# EAGLE design Kitty_Cannon_Schematic (EAGLE 9.6.2)
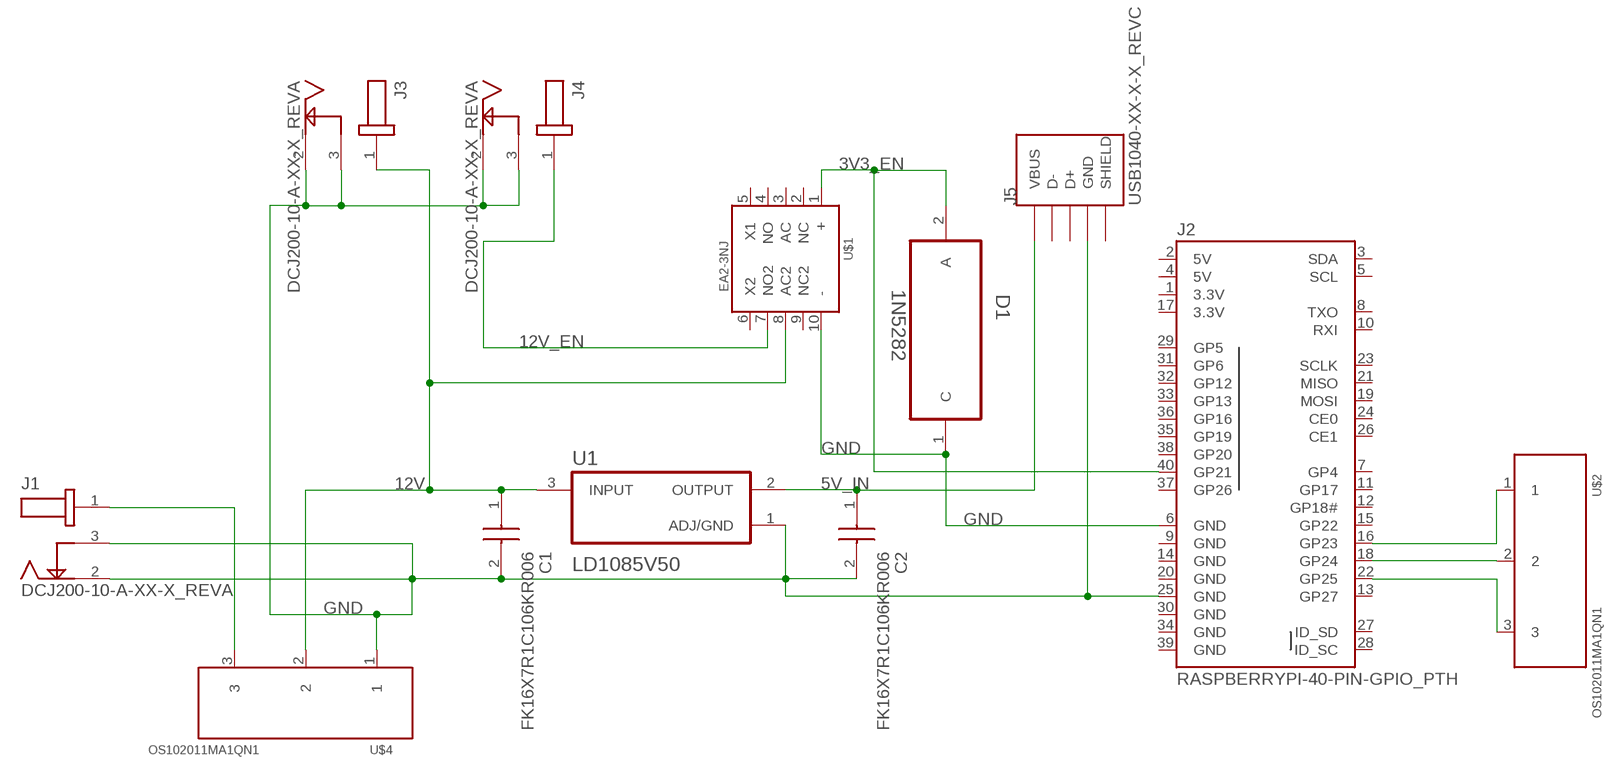
[diagram p0: schematic, sheet 1]

## Parts
C1  FK16X7R1C106KR006  [FK16]
C2  FK16X7R1C106KR006  [FK16]
D1  1N5282  [DIO_1N5282]
J1  DCJ200-10-A-XX-X_REVA  [GCT_DCJ200-10-A-XX-X_REVA]
J2  RASPBERRYPI-40-PIN-GPIO_PTH  [2X20_SHROUDED]
J3  DCJ200-10-A-XX-X_REVA  [GCT_DCJ200-10-A-XX-X_REVA]
J4  DCJ200-10-A-XX-X_REVA  [GCT_DCJ200-10-A-XX-X_REVA]
J5  USB1040-XX-X-X_REVC  [GCT_USB1040-XX-X-X_REVC]
U1  LD1085V50  [TO-220-3]
U$1  EA2-3NJ  [EA2-3NJ]
U$2  OS102011MA1QN1  [OS102011MA1QN1]
U$4  OS102011MA1QN1  [OS102011MA1QN1]

## Nets
3V3_EN: D1.2(A) J2.40(GP21) U$1.1(+)
5V_IN: C2.1 J5.1(VBUS) U1.2(OUTPUT)
12V: C1.1 J3.1 U1.3(INPUT) U$1.8(AC2) U$4.2
12V_EN: J4.1 U$1.7(NO2)
GND: C1.2 C2.2 D1.1(C) J1.2 J1.3 J2.6(GND) J2.25(GND) J3.2 J3.3 J4.2 J4.3 J5.4(GND) U1.1(ADJ/GND) U$1.10(-) U$4.1
N$1: J2.22(GP25) U$2.3
N$2: J2.16(GP23) U$2.1
N$3: J1.1 U$4.3
N$7: J2.18(GP24) U$2.2
Unconnected: J2.3(SDA) J2.5(SCL) J2.7(GP4) J2.8(TXO) J2.10(RXI) J2.11(GP17) J2.12(GP18#) J2.13(GP27) J2.15(GP22) J2.19(MOSI) J2.21(MISO) J2.23(SCLK) J2.24(CE0) J2.26(CE1) J2.27(ID_SD) J2.28(ID_SC) J2.29(GP5) J2.31(GP6) J2.32(GP12) J2.33(GP13) J2.35(GP19) J2.36(GP16) J2.37(GP26) J2.38(GP20) J5.2(D-) J5.3(D+) U$1.2(NC) U$1.3(AC) U$1.4(NO) U$1.5(X1) U$1.6(X2) U$1.9(NC2)

## Power pins joined to a net without a drawn wire
3.3V: J2.1(3.3V) J2.17(3.3V)
5V: J2.2(5V) J2.4(5V)
GND: J2.9(GND) J2.14(GND) J2.20(GND) J2.30(GND) J2.34(GND) J2.39(GND)
SHIELD: J5.5(SHIELD) J5.6(SHIELD)

## Library data of the parts
C1 C2 = FK16X7R1C106KR006:FK16X7R1C106KR006: MLCC with Dipped Radial Lead, Capacitance=10uF, LxWxT:5.5x6x3.5mm, Lead pitch:2.5mm Source: Datasheet <https://product.tdk.com/system/files/dam/doc/product/capacitor/ceramic/lead-mlcc/catalog/leadmlcc_conventional_fk_en.pdf>; DESCRIPTION: MLCC with Dipped Radial Lead, Capacitance=10uF, LxWxT:5.5x6x3.5mm, Lead pitch:2.5mm; HEIGHT: 6mm; MANUFACTURER_NAME: TDK; MANUFACTURER_PART_NUMBER: FK16X7R1C106KR006
D1 = 1N5282:1N5282: Small Signal Diode Check prices <https://pricing.snapeda.com/parts/1N5282/ON/view-part?ref=eda>; AVAILABILITY: In Stock; DESCRIPTION: 1N5282 Series 200 mA 80 V 500 mW Through Hole Small Signal Diode - DO-35; MF: ON; MP: 1N5282; PACKAGE: DO-35 NXP Semiconductors; PRICE: None; PURCHASE-URL: https://pricing.snapeda.com/search/part/1N5282/?ref=eda
J1 J3 J4 = DCJ200-10-A-XX-X_REVA:DCJ200-10-A-XX-X_REVA: DC Power Jack, Thru-Hole, Horizontal, with Locating Pegs, D2.0mm Check prices <https://pricing.snapeda.com/parts/DCJ200-10-A-K1-K/Global%20Connector%20Technology/view-part?ref=eda>; AVAILABILITY: In Stock; DESCRIPTION: Power Barrel Connector Jack 2.05mm ID (0.081), 5.50mm OD (0.217) Through Hole, Right Angle; MF: Global Connector Technology; MP: DCJ200-10-A-K1-K; PACKAGE: None; PRICE: None; PURCHASE-URL: https://pricing.snapeda.com/search/part/DCJ200-10-A-K1-K/?ref=eda
J2 = SparkFun-Connectors:RASPBERRYPI-40-PIN-GPIO: Raspberry Pi GPIO Header 2x20 pin connector, as found on B, B+, A+ models. Both shrouded PTH and SMT versions available. SparkFun Products: GPIO Shrouded Header <https://www.sparkfun.com/products/13054>- PTH SparkFun Pi Wedge (Preassembled) <https://www.sparkfun.com/products/13717>; PROD_ID: CONN-12263; SF_ID: PRT-13054
J5 = USB1040-XX-X-X_REVC:USB1040-XX-X-X_REVC: USB RECEPTACLE, TYPE A, 4 PIN, THROUGH HOLE, VERTICAL, WITH KINKED SHELL STAKES Check prices <https://pricing.snapeda.com/parts/USB1040-GF-L-B/Global%20Connector%20Technology/view-part?ref=eda>; AVAILABILITY: In Stock; DESCRIPTION: USB-A (USB TYPE-A) USB 2.0 Receptacle Connector 4 Position Through Hole; MF: Global Connector Technology; MP: USB1040-GF-L-B; PACKAGE: None; PRICE: None; PURCHASE-URL: https://pricing.snapeda.com/search/part/USB1040-GF-L-B/?ref=eda
U1 = LD1085V50:LD1085V50: None Check prices <https://pricing.snapeda.com/parts/LD1085V50/STMicroelectronics/view-part?ref=eda>; AVAILABILITY: In Stock; DESCRIPTION: Linear Voltage Regulator IC Positive Fixed 1 Output 3A TO-220AB; MF: STMicroelectronics; MP: LD1085V50; PACKAGE: TO-220-3 ON Semiconductor; PRICE: None; PURCHASE-URL: https://pricing.snapeda.com/search/part/LD1085V50/?ref=eda
U$1 = Kemet:EA2-3NJ
U$2 U$4 = C&K:OS102011MA1QN1

## Module EA2-3NJ
Ports: 

### Library data of the parts

## Board
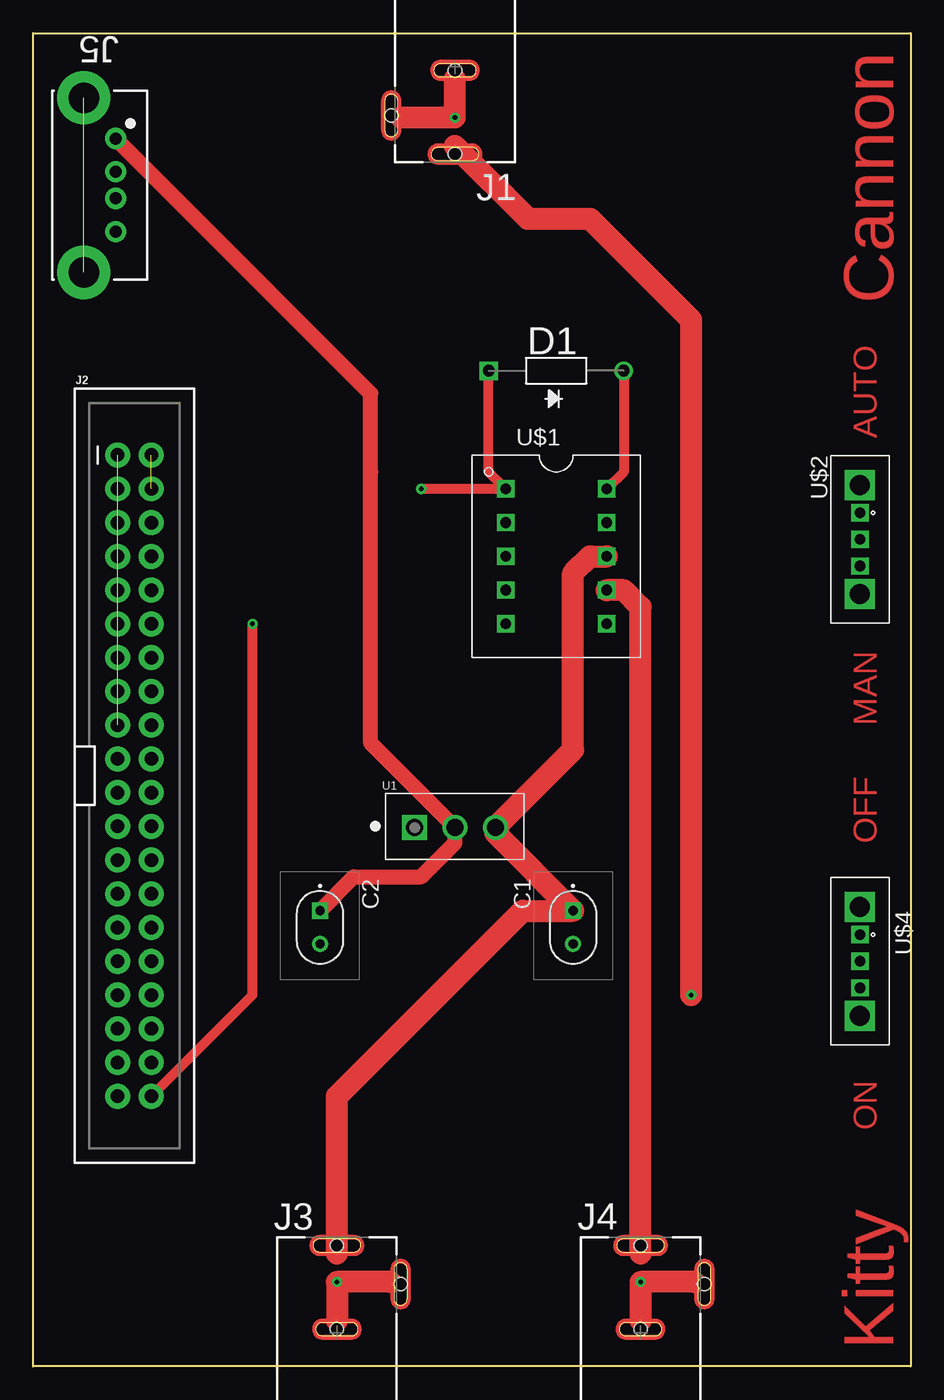
[diagram p1: board, top side]
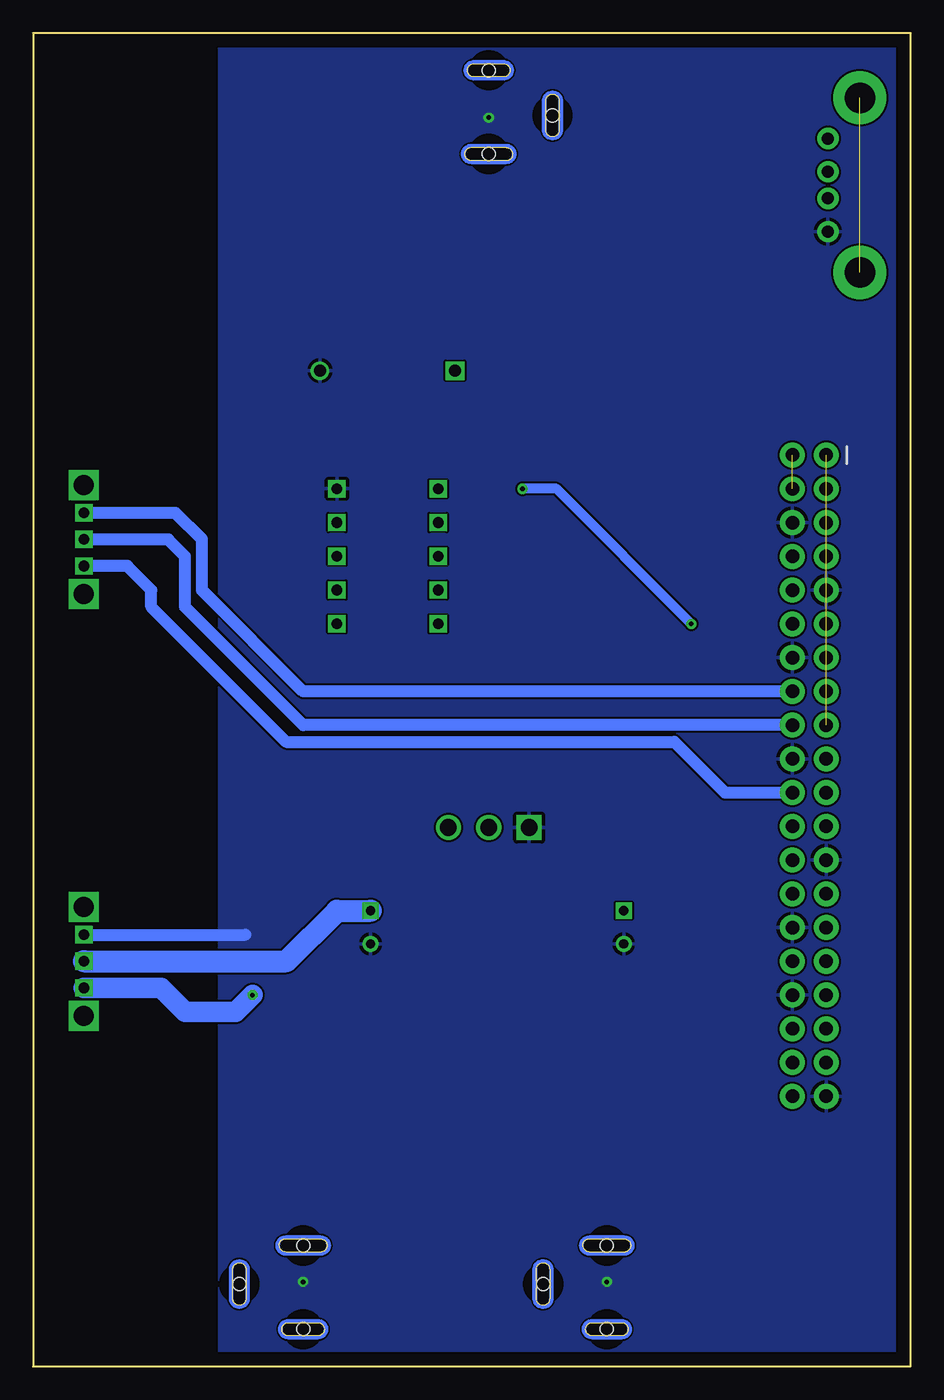
[diagram p2: board, bottom side, seen from below]

Size 66.04 x 100.33 mm. Coordinates in mm from the lower left corner, seen from the top.
Outline: 0,100 0,0
Outline: 0,0 0,100.33 66.04,100.33 66.04,0 0,0
Copper layers (1*16): Top 0.035mm / dielectric 1.5mm / Bottom 0.035mm
Design rules "default": minimum track width 6mil, minimum drill 0.35mm, track to track 6mil, track to pad 6mil, pad to pad 6mil, via to via 6mil, smd to smd 6mil, copper to edge 40mil, drill to drill 6mil, minimum pad ring 10mil, minimum via ring 8mil, stop-mask expansion 4mil, vias tented up to drill 0mil, thermal gap 10mil

### Footprints (pad centres in the part's own frame; a part is rotated, then mirrored left to right if it is on the bottom)
FK16 = drill 0.7 pad 1.2 square: 1 0,0 | drill 0.7 pad 1.2: 2 2.5,0
DIO_1N5282 = drill 0.889: 1 -10.16,0 | drill 0.889 square: 2 0,0
GCT_DCJ200-10-A-XX-X_REVA = smd 0.1 x 0.1: 1 0,5.95; 2 0,0.9; 3 4.2,3.65 | hole 1: 0,0.25; 4.8,3.65; 0,6.55
2X20_SHROUDED = drill 1.016 pad 1.88: 1 -1.27,24.13; 2 1.27,24.13; 3 -1.27,21.59; 4 1.27,21.59; 5 -1.27,19.05; 6 1.27,19.05; 7 -1.27,16.51; 8 1.27,16.51; 9 -1.27,13.97; 10 1.27,13.97; 11 -1.27,11.43; 12 1.27,11.43; 13 -1.27,8.89; 14 1.27,8.89; 15 -1.27,6.35; 16 1.27,6.35; 17 -1.27,3.81; 18 1.27,3.81; 19 -1.27,1.27; 20 1.27,1.27; 21 -1.27,-1.27; 22 1.27,-1.27; 23 -1.27,-3.81; 24 1.27,-3.81; 25 -1.27,-6.35; 26 1.27,-6.35; 27 -1.27,-8.89; 28 1.27,-8.89; 29 -1.27,-11.43; 30 1.27,-11.43; 31 -1.27,-13.97; 32 1.27,-13.97; 33 -1.27,-16.51; 34 1.27,-16.51; 35 -1.27,-19.05; 36 1.27,-19.05; 37 -1.27,-21.59; 38 1.27,-21.59; 39 -1.27,-24.13; 40 1.27,-24.13
GCT_USB1040-XX-X-X_REVC = drill 0.9 pad 1.6: 1 -3.5,2.4; 2 -1,2.4; 3 1,2.4; 4 3.5,2.4 | drill 2.3 pad 4: 5 -6.57,0; 6 6.57,0
TO-220-3 = drill 1.26 pad 1.89 square: 1 -3.04,-0.095 | drill 1.26 pad 1.89: 2 0,-0.095; 3 3.04,-0.095
EA2-3NJ = drill 0.8 square: 1 -7.62,12.7; 2 -7.62,10.16; 3 -7.62,7.62; 4 -7.62,5.08; 5 -7.62,2.54; 6 0,2.54; 7 0,5.08; 8 0,7.62; 9 0,10.16; 10 0,12.7
OS102011MA1QN1 = drill 0.8 square: 1 -2,0; 2 0,0; 3 2,0 | drill 1.5 square: 4 -4.1,0; 5 4.1,0

### Placement (x,y rotation side)
C1  40.64,34.29 270 top
C2  21.59,34.29 270 top
D1  34.29,74.93 180 top
J1  31.75,97.79 180 top
J2  7.62,44.45 0 top
J3  22.86,2.54 0 top
J4  45.72,2.54 0 top
J5  3.81,88.9 270 top
U1  31.75,40.64 0 top
U$1  43.18,53.34 0 top
U$2  62.23,62.23 270 top
U$4  62.23,30.48 270 top

### Tracks (layer width: path | path; a pad name or v marks a point on that pad's centre or on a via)
3.3V  (1 unrouted)
3V3_EN  (via drill 0.35)
  Top 0.762: D1.2 34.29,67.31 U$1.1 v29.21,66.04 | J2.40 16.51,27.94 v16.51,55.88
  Bottom 0.762: v16.51,55.88 26.67,66.04 v29.21,66.04
5V  (1 unrouted)
5V_IN
  Top 1.143: C2.1 24.13,36.83 29.21,36.83 31.75,39.37 U1.2 25.4,46.9 25.4,67.31 25.4,73.21 J5.1
12V
  Top 0.152: 34.79,40.14 U1.3
  Top 1.651: U1.3 40.64,46.4 40.64,59.69 41.91,60.96 U$1.8 | 34.79,40.14 C1.1 36.83,34.29 22.86,20.32 J3.1
  Bottom 1.651: C1.1 43.18,34.29 46.99,30.48 U$4.2
12V_EN
  Top 1.651: U$1.7 44.45,58.42 45.72,57.15 J4.1
GND  (via drill 0.35)
  Top 0.152: J4.3 49.76,6.35
  Top 0.406: J3.3 26.9,6.35 | J1.3 27.71,93.98
  Top 0.762: D1.1 44.45,67.31 U$1.10
  Top 1.651: J3.2 v22.86,6.35 26.9,6.35 | J4.2 v45.72,6.35 49.76,6.35 | J1.2 v31.75,93.98 27.71,93.98
  Bottom 0.889: U$4.1 50.07,32.48
  pour Bottom: 0,100.33 52.07,100.33 52.07,0 0,0
N$1
  Bottom 0.889: U$2.3 58.96,60.23 57.15,58.42 57.15,57.15 46.99,46.99 17.78,46.99 13.97,43.18 J2.22
N$2
  Bottom 0.889: J2.16 45.72,50.8 53.34,58.42 53.34,62.23 55.34,64.23 U$2.1
N$3  (via drill 0.35)
  Top 1.651: v49.53,27.94 49.53,78.74 41.91,86.36 37.23,86.36 J1.1
  Bottom 1.524: U$4.3 56.42,28.48 54.61,26.67 50.8,26.67 v49.53,27.94
N$7
  Bottom 0.889: J2.18 45.72,48.26 54.61,57.15 54.61,60.96 55.88,62.23 U$2.2
SHIELD  (1 unrouted)

### Text on the board
Top: Cannon | AUTO | MAN | OFF | ON | Kitty